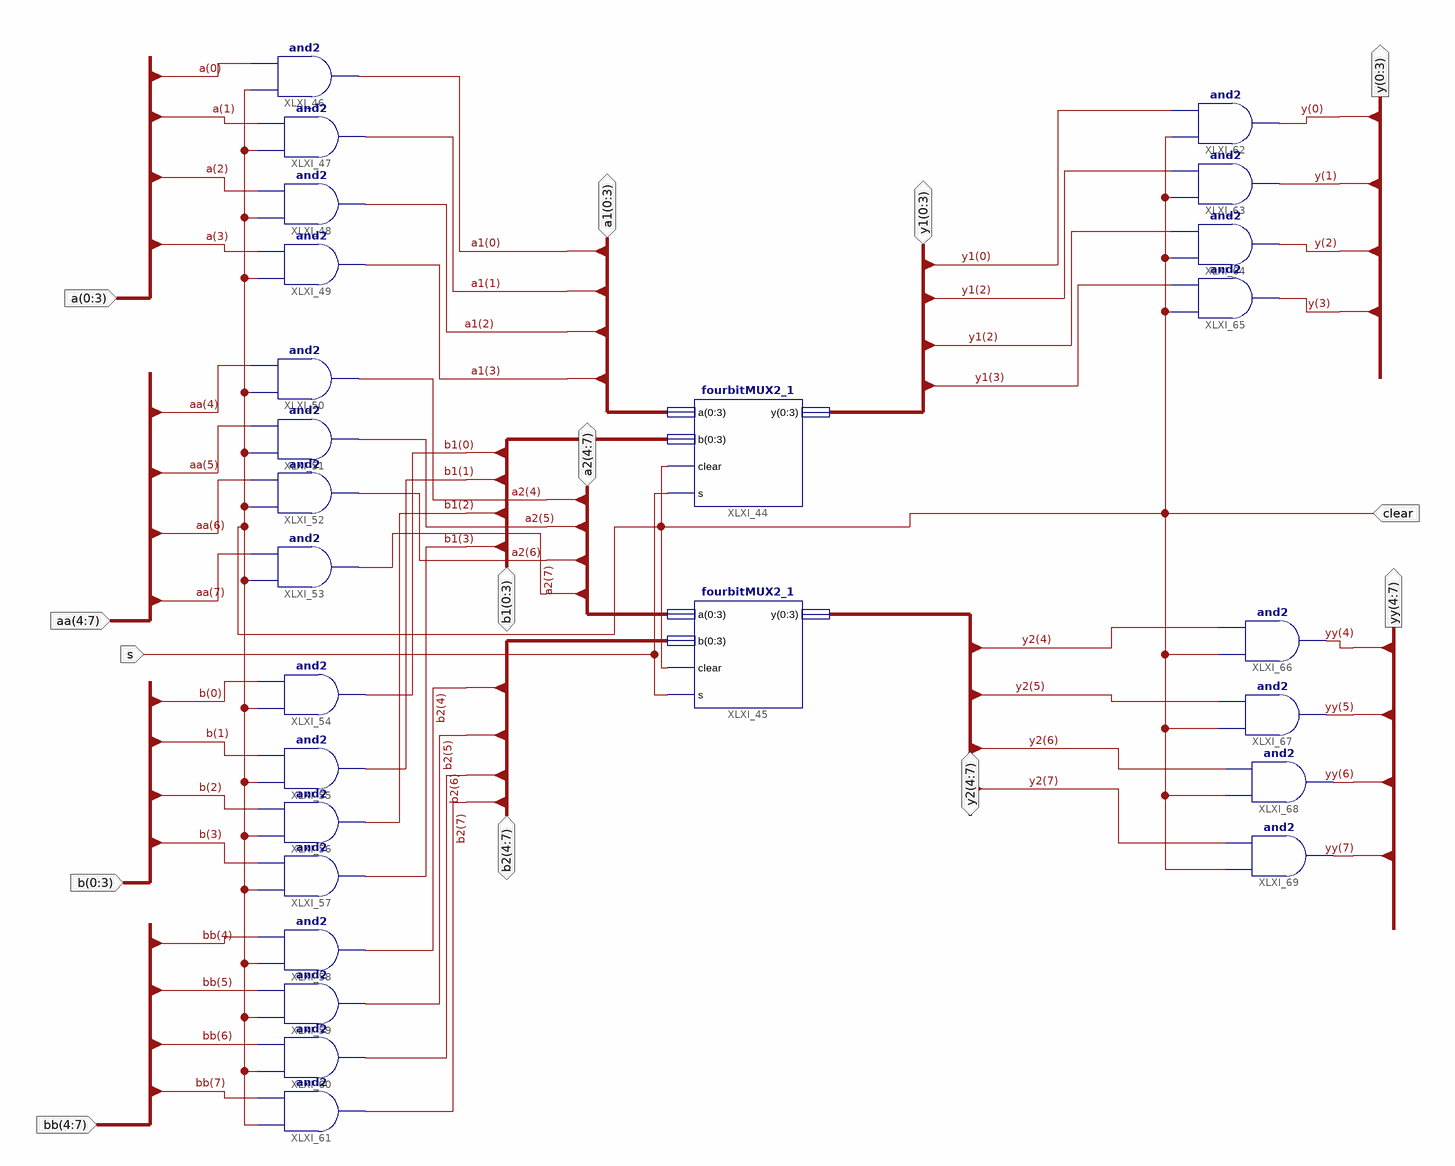
[diagram p0: schematic sheet 1]
// Xilinx ISE schematic Eightbit2_1mux.sch (artix7) as structural Verilog: 26 symbols, 14 ports
module Eightbit2_1mux (
  input  [0:3] a,
  input  [4:7] aa,
  input  [0:3] b,
  input  [4:7] bb,
  input  s,
  input  clear,
  inout  [0:3] a1,
  inout  [4:7] a2,
  inout  [0:3] b1,
  inout  [4:7] b2,
  inout  [0:3] y1,
  inout  [4:7] y2,
  output [0:3] y,
  output [4:7] yy
);

  fourbitMUX2_1 XLXI_44 (.a(a1), .b(b1), .clear(clear), .s(s), .y(y1));
  fourbitMUX2_1 XLXI_45 (.a(a2), .b(b2), .clear(clear), .s(s), .y(y2));
  and XLXI_46 (a1[0], clear, a[0]);
  and XLXI_47 (a1[1], clear, a[1]);
  and XLXI_48 (a1[2], clear, a[2]);
  and XLXI_49 (a1[3], clear, a[3]);
  and XLXI_50 (a2[4], clear, aa[4]);
  and XLXI_51 (a2[5], clear, aa[5]);
  and XLXI_52 (a2[6], clear, aa[6]);
  and XLXI_53 (a2[7], clear, aa[7]);
  and XLXI_54 (b1[0], clear, b[0]);
  and XLXI_55 (b1[1], clear, b[1]);
  and XLXI_56 (b1[2], clear, b[2]);
  and XLXI_57 (b1[3], clear, b[3]);
  and XLXI_58 (b2[4], clear, bb[4]);
  and XLXI_59 (b2[5], clear, bb[5]);
  and XLXI_60 (b2[6], clear, bb[6]);
  and XLXI_61 (b2[7], clear, bb[7]);
  and XLXI_62 (y[0], clear, y1[0]);
  and XLXI_63 (y[1], clear, y1[2]);
  and XLXI_64 (y[2], clear, y1[2]);
  and XLXI_65 (y[3], clear, y1[3]);
  and XLXI_66 (yy[4], clear, y2[4]);
  and XLXI_67 (yy[5], clear, y2[5]);
  and XLXI_68 (yy[6], clear, y2[6]);
  and XLXI_69 (yy[7], clear, y2[7]);
endmodule
